# EAGLE design BatteryPCB2989 (EAGLE 7.2.0)
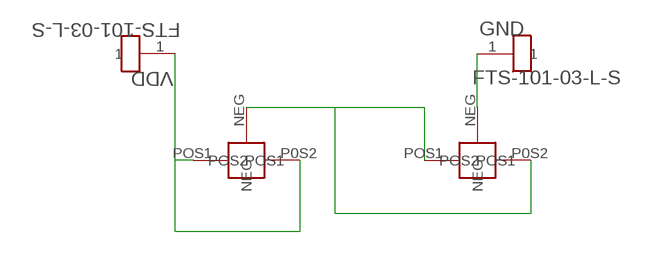
[diagram p0: schematic, sheet 1]

## Parts
GND  FTS-101-03-L-S  [SAMTEC_FTS-101-03-S]
U$1  2989NOHOLE  [2989NOHOLE]
U$2  2989NOHOLE  [2989NOHOLE]
VDD  FTS-101-03-L-S  [SAMTEC_FTS-101-03-S]

## Nets
N$1: U$1.NEG U$2.P0S2(POS2) U$2.POS1
N$2: GND.1 U$2.NEG
N$3: U$1.P0S2(POS2) U$1.POS1 VDD.1

## Library data of the parts
GND VDD = samtec_fts:FTS-101-03-L-S
U$1 U$2 = keystone-battery-holder:2989NOHOLE

## Board
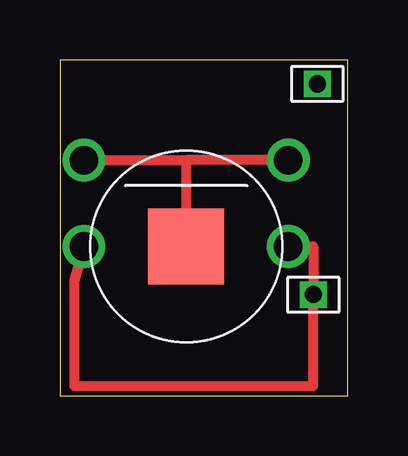
[diagram p1: board, top side]
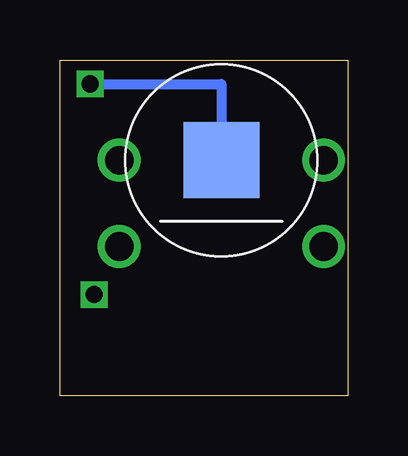
[diagram p2: board, bottom side, seen from below]

Size 12 x 14 mm. Coordinates in mm from the lower left corner, seen from the top.
Outline: 0,0 12,0 12,14 0,14 0,0
Copper layers (1*16): Top 0.035mm / dielectric 1.5mm / Bottom 0.035mm
Design rules "MF_Standard_2_Layer": minimum track width 6mil, minimum drill 12mil, track to track 6mil, track to pad 6mil, pad to pad 6mil, via to via 6mil, smd to smd 0mil, copper to edge 10mil, drill to drill 10mil, minimum pad ring 6mil, minimum via ring 6mil, stop-mask expansion 2mil, vias tented up to drill 25mil, thermal gap 10mil

### Footprints (pad centres in the part's own frame; a part is rotated, then mirrored left to right if it is on the bottom)
SAMTEC_FTS-101-03-S = drill 0.711 pad 1.118 square: 1 0,0
2989NOHOLE = smd 3.17 x 3.17: NEG 0,0 | drill 1.19: P0S2 4.265,0; POS1 -4.265,0

### Placement (x,y rotation side)
GND  10.74,13 90 top
U$1  5.26,6.22 180 top
U$2  5.26,9.82 0 bottom
VDD  10.57,4.21 90 top

### Tracks (layer width: path | path; a pad name or v marks a point on that pad's centre or on a via)
N$1
  Top 0.406: U$2.P0S2 5.26,9.82 | 5.26,9.82 U$1.NEG | U$2.POS1 5.26,9.82
N$2
  Bottom 0.406: GND.1 5.26,13 U$2.NEG
N$3
  Top 0.406: U$1.P0S2 0.6,4.8 0.6,0.4 10.57,0.4 10.57,0.8 VDD.1 10.57,6.22 U$1.POS1